# Altium project TMS320 EMIF Breakout.PrjPcb
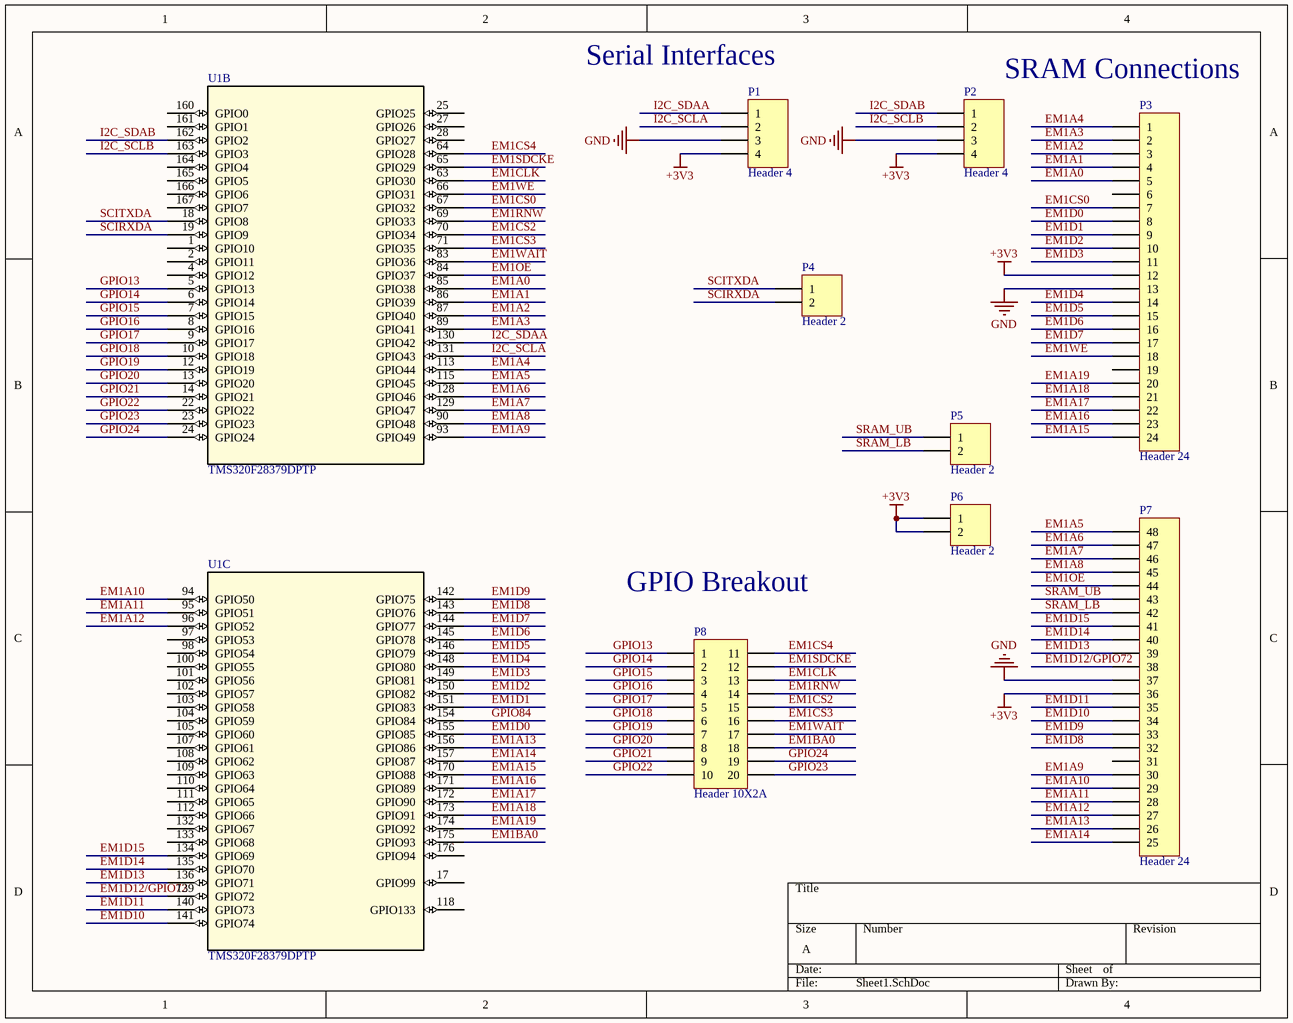
[diagram p0: Sheet1.SchDoc]
3 sheets, 94 parts. Net scope: global (net labels, ports and power ports of the same name join across sheets).
Board file: PCB1.PcbDoc
Sheets:
  Sheet1.SchDoc
  Sheet2.SchDoc
  Sheet3.SchDoc

## Sheet Sheet1.SchDoc
size A

### Parts
P1  Header 4  [HDR1X4]
P2  Header 4  [HDR1X4]
P3  Header 24  [HDR1X24]
P4  Header 2  [HDR1X2]
P5  Header 2  [HDR1X2]
P6  Header 2  [HDR1X2]
P7  Header 24  [HDR1X24]
P8  Header 10X2A  [HDR2X10_CEN]
U1  TMS320F28379DPTP  [PTP0176F_L]  (parts B,C of 5)

### Nets
+3V3: P1.4 P2.4 P3.12 P6.1 P6.2 P7.13(36)
GND: P1.3 P2.3 P3.13 P7.12(37)
EM1A0: P3.5 U1.85(GPIO38)
EM1A1: P3.4 U1.86(GPIO39)
EM1A2: P3.3 U1.87(GPIO40)
EM1A3: P3.2 U1.89(GPIO41)
EM1A4: P3.1 U1.113(GPIO44)
EM1A5: P7.1(48) U1.115(GPIO45)
EM1A6: P7.2(47) U1.128(GPIO46)
EM1A7: P7.3(46) U1.129(GPIO47)
EM1A8: P7.4(45) U1.90(GPIO48)
EM1A9: P7.19(30) U1.93(GPIO49)
EM1A10: P7.20(29) U1.94(GPIO50)
EM1A11: P7.21(28) U1.95(GPIO51)
EM1A12: P7.22(27) U1.96(GPIO52)
EM1A13: P7.23(26) U1.156(GPIO86)
EM1A14: P7.24(25) U1.157(GPIO87)
EM1A15: P3.24 U1.170(GPIO88)
EM1A16: P3.23 U1.171(GPIO89)
EM1A17: P3.22 U1.172(GPIO90)
EM1A18: P3.21 U1.173(GPIO91)
EM1A19: P3.20 U1.174(GPIO92)
EM1BA0: P8.18 U1.175(GPIO93)
EM1CLK: P8.13 U1.63(GPIO30)
EM1CS0: P3.7 U1.67(GPIO32)
EM1CS2: P8.15 U1.70(GPIO34)
EM1CS3: P8.16 U1.71(GPIO35)
EM1CS4: P8.11 U1.64(GPIO28)
EM1D0: P3.8 U1.155(GPIO85)
EM1D1: P3.9 U1.151(GPIO83)
EM1D2: P3.10 U1.150(GPIO82)
EM1D3: P3.11 U1.149(GPIO81)
EM1D4: P3.14 U1.148(GPIO80)
EM1D5: P3.15 U1.146(GPIO79)
EM1D6: P3.16 U1.145(GPIO78)
EM1D7: P3.17 U1.144(GPIO77)
EM1D8: P7.17(32) U1.143(GPIO76)
EM1D9: P7.16(33) U1.142(GPIO75)
EM1D10: P7.15(34) U1.141(GPIO74)
EM1D11: P7.14(35) U1.140(GPIO73)
EM1D12/GPIO72: P7.11(38) U1.139(GPIO72)
EM1D13: P7.10(39) U1.136(GPIO71)
EM1D14: P7.9(40) U1.135(GPIO70)
EM1D15: P7.8(41) U1.134(GPIO69)
EM1OE: P7.5(44) U1.84(GPIO37)
EM1RNW: P8.14 U1.69(GPIO33)
EM1SDCKE: P8.12 U1.65(GPIO29)
EM1WAIT: P8.17 U1.83(GPIO36)
EM1WE: P3.18 U1.66(GPIO31)
GPIO13: P8.1 U1.5(GPIO13)
GPIO14: P8.2 U1.6(GPIO14)
GPIO15: P8.3 U1.7(GPIO15)
GPIO16: P8.4 U1.8(GPIO16)
GPIO17: P8.5 U1.9(GPIO17)
GPIO18: P8.6 U1.10(GPIO18)
GPIO19: P8.7 U1.12(GPIO19)
GPIO20: P8.8 U1.13(GPIO20)
GPIO21: P8.9 U1.14(GPIO21)
GPIO22: P8.10 U1.22(GPIO22)
GPIO23: P8.20 U1.23(GPIO23)
GPIO24: P8.19 U1.24(GPIO24)
GPIO84: U1.154(GPIO84)
I2C_SCLA: P1.2 U1.131(GPIO43)
I2C_SCLB: P2.2 U1.163(GPIO3)
I2C_SDAA: P1.1 U1.130(GPIO42)
I2C_SDAB: P2.1 U1.162(GPIO2)
SCIRXDA: P4.2 U1.19(GPIO9)
SCITXDA: P4.1 U1.18(GPIO8)
SRAM_LB: P5.2 P7.7(42)
SRAM_UB: P5.1 P7.6(43)

Not connected (* = marked no-connect by the designer): P3 6 19; P7 18(31); U1 1(GPIO10) 2(GPIO11) 4(GPIO12) 17(GPIO99) 25(GPIO25) 27(GPIO26) 28(GPIO27) 97(GPIO53) 98(GPIO54) 100(GPIO55) 101(GPIO56) 102(GPIO57) 103(GPIO58) 104(GPIO59) 105(GPIO60) 107(GPIO61) 108(GPIO62) 109(GPIO63) 110(GPIO64) 111(GPIO65) 112(GPIO66) 118(GPIO133) 132(GPIO67) 133(GPIO68) 160(GPIO0) 161(GPIO1) 164(GPIO4) 165(GPIO5) 166(GPIO6) 167(GPIO7) 176(GPIO94)

### Notes on the sheet
- (near P1) Serial Interfaces
- SRAM Connections
- GPIO Breakout

### Library data of the parts
P1 P2 = Header 4: Header, 4-Pin; LatestRevisionDate: 17-Jul-2002; LatestRevisionNote: Re-released for DXP Platform.; Publisher: Altium Limited
P3 P7 = Header 24: Header, 24-Pin; LatestRevisionDate: 17-Jul-2002; LatestRevisionNote: Re-released for DXP Platform.; Publisher: Altium Limited
P4-P6 = Header 2: Header, 2-Pin; LatestRevisionDate: 17-Jul-2002; LatestRevisionNote: Re-released for DXP Platform.; Publisher: Altium Limited
P8 = Header 10X2A: Header, 10-Pin, Dual row; LatestRevisionDate: 17-Jul-2002; LatestRevisionNote: Re-released for DXP Platform.; Publisher: Altium Limited
U1 = TMS320F28379DPTP: Imported; PartNumber: TMS320F28379DPTPS; Manufacturer: Texas Instruments; RefDes: RefDes; TYPE: TYPE; Value: Value

## Sheet Sheet2.SchDoc
size A
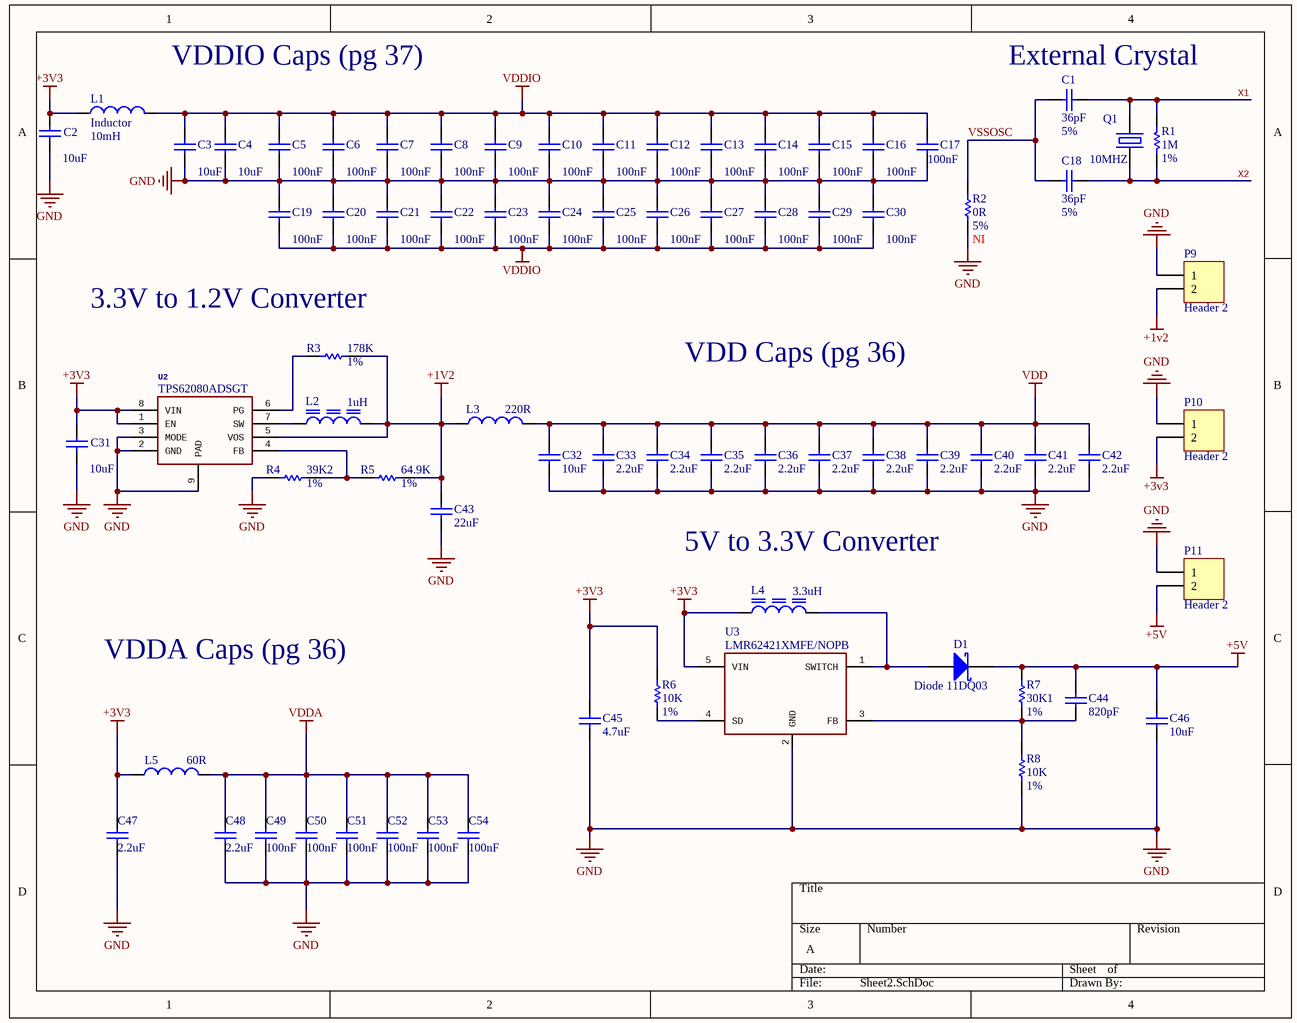
[diagram p1: Sheet2.SchDoc]

### Parts
C1  Rating: 5%  [C0805]  (hidden comment: 36pF)
C2  value 10uF  [C0805]  (hidden comment: Cap Semi)
C3  value 10uF  [C0805]  (hidden comment: Cap Semi)
C4  value 10uF  [C0805]  (hidden comment: Cap Semi)
C5  value 100nF  [C0805]  (hidden comment: Cap Semi)
C6  value 100nF  [C0805]
C7  value 100nF  [C0805]  (hidden comment: Cap Semi)
C8  value 100nF  [C0805]  (hidden comment: Cap Semi)
C9  value 100nF  [C0805]  (hidden comment: Cap Semi)
C10  value 100nF  [C0805]
C11  value 100nF  [C0805]  (hidden comment: Cap Semi)
C12  value 100nF  [C0805]  (hidden comment: Cap Semi)
C13  value 100nF  [C0805]  (hidden comment: Cap Semi)
C14  value 100nF  [C0805]  (hidden comment: Cap Semi)
C15  value 100nF  [C0805]  (hidden comment: Cap Semi)
C16  value 100nF  [C0805]  (hidden comment: Cap Semi)
C17  value 100nF  [C0805]  (hidden comment: Cap Semi)
C18  Rating: 5%  [C0805]  (hidden comment: 36pF)
C19  value 100nF  [C0805]  (hidden comment: Cap Semi)
C20  value 100nF  [C0805]
C21  value 100nF  [C0805]  (hidden comment: Cap Semi)
C22  value 100nF  [C0805]  (hidden comment: Cap Semi)
C23  value 100nF  [C0805]  (hidden comment: Cap Semi)
C24  value 100nF  [C0805]
C25  value 100nF  [C0805]  (hidden comment: Cap Semi)
C26  value 100nF  [C0805]  (hidden comment: Cap Semi)
C27  value 100nF  [C0805]  (hidden comment: Cap Semi)
C28  value 100nF  [C0805]  (hidden comment: Cap Semi)
C29  value 100nF  [C0805]  (hidden comment: Cap Semi)
C30  value 100nF  [C0805]  (hidden comment: Cap Semi)
C31  value 10uF  [C0805]  (hidden comment: Cap Semi)
C32  10uF  [C0805]
C33  2.2uF  [C0805]
C34  2.2uF  [C0805]
C35  2.2uF  [C0805]
C36  2.2uF  [C0805]
C37  2.2uF  [C0805]
C38  2.2uF  [C0805]
C39  2.2uF  [C0805]
C40  2.2uF  [C0805]
C41  2.2uF  [C0805]
C42  2.2uF  [C0805]
C43  22uF  [C0805]
C44  820pF  [C0805]
C45  4.7uF  [C0805]
C46  10uF  [C0805]
C47  2.2uF  [C0805]
C48  2.2uF  [C0805]
C49  100nF  [C0805]
C50  100nF  [C0805]
C51  100nF  [C0805]
C52  100nF  [C0805]
C53  100nF  [C0805]
C54  100nF  [C0805]
D1  Diode 11DQ03  [DO-204AL]
L1  Inductor  value 10mH  [6-0805_L]
L2  1uH  [6-0805_L]
L3  220R  [6-0805_L]
L4  3.3uH  [6-0805_L]
L5  60R  [6-0805_L]
P9  Header 2  [HDR1X2]
P10  Header 2  [HDR1X2]
P11  Header 2  [HDR1X2]
Q1  value 10MHZ  [HC-49U]  (hidden comment: ATS100B-E)
R1  Rating: 1%  [6-0805_L]  (hidden comment: 1M)
R2  Rating: 5%  ASSY: NI  [6-0805_L]  (hidden comment: 0R)
R3  Rating: 1%  [6-0805_L]  (hidden comment: 178K)
R4  Rating: 1%  [6-0805_L]  (hidden comment: 39K2)
R5  Rating: 1%  [6-0805_L]  (hidden comment: 64.9K)
R6  Rating: 1%  [6-0805_L]  (hidden comment: 10K)
R7  Rating: 1%  [6-0805_L]  (hidden comment: 30K1)
R8  Rating: 1%  [6-0805_L]  (hidden comment: 10K)
U2  TPS62080ADSGT  [SON50P200X200X80-9N]
U3  LMR62421XMFE/NOPB  [DBV5-L]

### Nets
+1V2: C43.2 L2.2 L3.1 P9.2 R3.2 R5.2 U2.5(VOS)
+3V3: C2.2 C31.2 C45.2 C47.2 L1.1 L4.1 L5.1 P10.2 R6.1 U2.1(EN) U2.8(VIN) U3.5(VIN)
+5V: C44.2 C46.1 D1.2(K) P11.2 R7.1
GND: C2.1 C3.1 C4.1 C5.1 C6.1 C7.1 C8.1 C9.1 C10.1 C11.1 C12.1 C13.1 C14.1 C15.1 C16.1 C17.1 C19.2 C20.2 C21.2 C22.2 C23.2 C24.2 C25.2 C26.2 C27.2 C28.2 C29.2 C30.2 C31.1 C32.1 C33.1 C34.1 C35.1 C36.1 C37.1 C38.1 C39.1 C40.1 C41.1 C42.1 C43.1 C45.1 C46.2 C47.1 C48.1 C49.1 C50.1 C51.1 C52.1 C53.1 C54.1 P9.1 P10.1 P11.1 R2.2 R4.1 R8.2 U2.2(GND) U2.3(MODE) U2.9(PAD) U3.2(GND)
VDD: C32.2 C33.2 C34.2 C35.2 C36.2 C37.2 C38.2 C39.2 C40.2 C41.2 C42.2 L3.2
VDDA: C48.2 C49.2 C50.2 C51.2 C52.2 C53.2 C54.2 L5.2
VDDIO: C3.2 C4.2 C5.2 C6.2 C7.2 C8.2 C9.2 C10.2 C11.2 C12.2 C13.2 C14.2 C15.2 C16.2 C17.2 C19.1 C20.1 C21.1 C22.1 C23.1 C24.1 C25.1 C26.1 C27.1 C28.1 C29.1 C30.1 L1.2
VSSOSC: C1.2 C18.2 R2.1
X1: C1.1 Q1.2 R1.2
X2: C18.1 Q1.1 R1.1
NetC44_1: C44.1 R7.2 R8.1 U3.3(FB)
NetD1_1: D1.1(A) L4.2 U3.1(SWITCH)
NetL2_1: L2.1 U2.7(SW)
NetR3_1: R3.1 U2.6(PG)
NetR4_2: R4.2 R5.1 U2.4(FB)
NetR6_2: R6.2 U3.4(SD)

### Notes on the sheet
- VDDIO Caps (pg 37)
- (near C1) External Crystal
- 3.3V to 1.2V Converter
- VDD Caps (pg 36)
- 5V to 3.3V Converter
- VDDA Caps (pg 36)

### Library data of the parts
C1 C18 = 1004001100255: CAP,36pF,+/-5%,C0G,50V,SMD0402; Manufacturer: MURATA; Manufacturer Part Number: GRM1555C1H360JA01D; Embest PN: 1004001100255; Value: 36pF; Part Type: Ceramic Capacitor
C2-C4 C31 = Cap Semi: 10uF; Published: 8-Jun-2000; LatestRevisionDate: 29-May-2009; LatestRevisionNote: IPC-7351 Footprint Added.; PackageReference: C1206; Publisher: Altium Limited; PackageDescription: Chip Capacitor
C5-C17 C19-C30 = Cap Semi: 100nF; Published: 8-Jun-2000; LatestRevisionDate: 29-May-2009; LatestRevisionNote: IPC-7351 Footprint Added.; PackageReference: C1206; Publisher: Altium Limited; PackageDescription: Chip Capacitor
C32 = 1004001100128: CAP,10UF,+/-20%,X5R,6.3V,SMD0603; Manufacturer: MURATA; Manufacturer Part Number: GRM188R60J106ME47D; Rating: 20%; Embest PN: 1004001100128; Value: 10uF; Part Type: Ceramic Capacitor
C33-C42 C47 C48 = 1004001100059: CAP,2.2UF,+/-20%,X5R,6.3V,SMD0402; Manufacturer: MURATA; Manufacturer Part Number: GRM155R60J225ME15D; Rating: 20%; Embest PN: 1004001100059; Value: 2.2uF; Part Type: Ceramic Capacitor
C43 = 1004001100130: CAP,22UF,+/-20%,X5R,6.3V,SMD0603; Manufacturer: MURATA; Manufacturer Part Number: GRM188R60J226MEA0D; Rating: 20%; Embest PN: 1004001100130; Value: 22uF; Part Type: Ceramic Capacitor
C44 = 1004001100029: CAP,820PF,+/-5%,C0G,50V,SMD0402; Manufacturer: MURATA; Manufacturer Part Number: GRM1555C1H821JA01D; Rating: 5%; Embest PN: 1004001100029; Value: 820pF; Part Type: Ceramic Capacitor
C45 = 1004001100218: CAP,4.7UF,+/-20%,X5R,6.3V,SMD0402 fix PN add D（20151023）; Manufacturer: MURATA; Manufacturer Part Number: GRM155R60J475ME47D; Rating: 20%; Embest PN: 1004001100218; Value: 4.7uF; Part Type: Ceramic Capacitor
C46 = 1004001100183: CAP,10UF,+/-10%,X7R,25V,SMD1210; Manufacturer: MURATA; Manufacturer Part Number: GRM32DR71E106KA12L; Rating: 10%; Embest PN: 1004001100183; Value: 10uF; Part Type: Ceramic Capacitor
C49-C54 = 1004001100187: CAP,100NF(0.1uf),+/-10%,X5R,10V,SMD0402; Manufacturer: MURATA; Manufacturer Part Number: GRM155R61A104KA01D; Rating: 10%; Embest PN: 1004001100187; Value: 100nF; Part Type: Ceramic Capacitor
D1 = Diode 11DQ03: Schottky Rectifier; Published: 8-Jun-2000; LatestRevisionDate: 17-Jul-2002; LatestRevisionNote: Re-released for DXP Platform.; DatasheetVersion: Dec-1997; PackageReference: DO-204AL; Publisher: Altium Limited; PackageDescription: Diode, Axial; Body 5.2 x 2.7 mm (LxDia. max), Lead Dia. 0.86 mm (max); Code_JEDEC: DO-204-AL; ComponentLink1Description: Manufacturer Link; ComponentLink1URL: http://www.irf.com/; ComponentLink2Description: Datasheet; ComponentLink2URL: http://www.irf.com/product-info/datasheets/data/11dq03.pdf
L1 = Inductor: Code_IEC: 1005; Published: 8-Jun-2000; LatestRevisionDate: 29-May-2009; LatestRevisionNote: IPC-7351 Footprint Added.; PackageReference: 0402-A; Publisher: Altium Limited; PackageDescription: Chip Inductor; Code_JEITA: 0402
L2 = 1005001100053: FIXED IND 1UH 1.62A 40 MOHM SMD,+/-30%; Manufacturer: MURATA; Manufacturer Part Number: LQH3NPN1R0NJ0L; Embest PN: 1005001100053; Value: 1uH; Part Type: Inductor; Rating: 1.62A
L3 = 1005005100064: FERRITE BEAD 220 OHM 0402,+/-25%; Manufacturer: Taiyo Yuden; Manufacturer Part Number: BKP1005EM221-T; Embest PN: 1005005100064; Value: 220R; Part Type: Ferrite Bead
L4 = 1005004100014: Power Inductor,Magnetic shielded,3.3uH,1.4A,0.085ohm,3.8X3.8X1.6mm,SMD; Manufacturer: SUMIDA; Manufacturer Part Number: CDRH3D16/HPNP-3R3NC; Embest PN: 1005004100014; Value: 3.3uH; Part Type: Inductor; Rating: 1.4A
L5 = 1005005100005: Ferrite Bead,60ohm@100MHz,+/-25%,1700mA,0.06ohm,SMD0402; Manufacturer: MURATA; Manufacturer Part Number: BLM15PD600SN1D; Embest PN: 1005005100005; Value: 60R; Part Type: Ferrite Bead; Rating: 1700mA
P9-P11 = Header 2: Header, 2-Pin; LatestRevisionDate: 17-Jul-2002; LatestRevisionNote: Re-released for DXP Platform.; Publisher: Altium Limited
Q1 = 1008002200125: Crystal 10.0000MHz 30ppm 18pF 60 Ohm -40°C - 85°C Through Hole HC49/US; Manufacturer: CTS; Embest PN: 1008002200125; Part Type: Crystal; Manufacturer Part Number: ATS100B-E
R1 = 1003001100155: RES,1M,+/-1%,1/16W,SMD0402; Manufacturer: YAGEO; Manufacturer Part Number: RC0402FR-071ML; Embest PN: 1003001100155; Value: 1M; Part Type: Thick film Resistor
R2 = 1003001100001: RES,0R,+/-5%,1/16W,SMD0402; Manufacturer: YAGEO; Manufacturer Part Number: RC0402JR-070RL; Embest PN: 1003001100001; Value: 0R; Part Type: Thick film Resistor
R3 = 1003001100723: RES, 178K OHM, 1%, 1/10W, SMD0402; Manufacturer: PANASONIC; Manufacturer Part Number: ERJ-2RKF1783X; Embest PN: 1003001100723; Value: 178K; Part Type: Thick film Resistor
R4 = 1003001100098: RES,39K2,+/-1%,1/16W,SMD0402; Manufacturer: YAGEO; Manufacturer Part Number: RC0402FR-0739K2L; Embest PN: 1003001100098; Value: 39K2; Part Type: Thick film Resistor
R5 = 1003001100730: RES, 64.9K OHM, 1%, 1/10W, SMD0402; Manufacturer: PANASONIC; Manufacturer Part Number: ERJ-2RKF6492X; Embest PN: 1003001100730; Value: 64.9K; Part Type: Thick film Resistor
R6 R8 = 1003001100071: RES,10K,+/-1%,1/16W,SMD0402; Manufacturer: YAGEO; Manufacturer Part Number: RC0402FR-0710KL; Embest PN: 1003001100071; Value: 10K; Part Type: Thick film Resistor
R7 = 1003001100091: RES,30K1,+/-1%,1/16W,SMD0402; Manufacturer: YAGEO; Manufacturer Part Number: RC0402FR-0730K1L; Embest PN: 1003001100091; Value: 30K1; Part Type: Thick film Resistor
U2 = 1002005100089C: IC REG BUCK SYNC ADJ 1.2A 8WSON; Manufacturer: TI; Embest PN: 1002005100089C; Value: TPS62080ADSGT; Part Type: DC-DC; Manufacturer Part Number: TPS62080ADSGT
U3 = 1002005100073C: Conv DC-DC Single Step Up 2.7V to 5.5V 5-Pin SOT-23 T/R ,CUSTOMER SUPPLY; Manufacturer: TI; Embest PN: 1002005100073C; Value: LMR62421XMFE/NOPB; Part Type: DC-DC; Manufacturer Part Number: LMR62421XMFE/NOPB

## Sheet Sheet3.SchDoc
size A
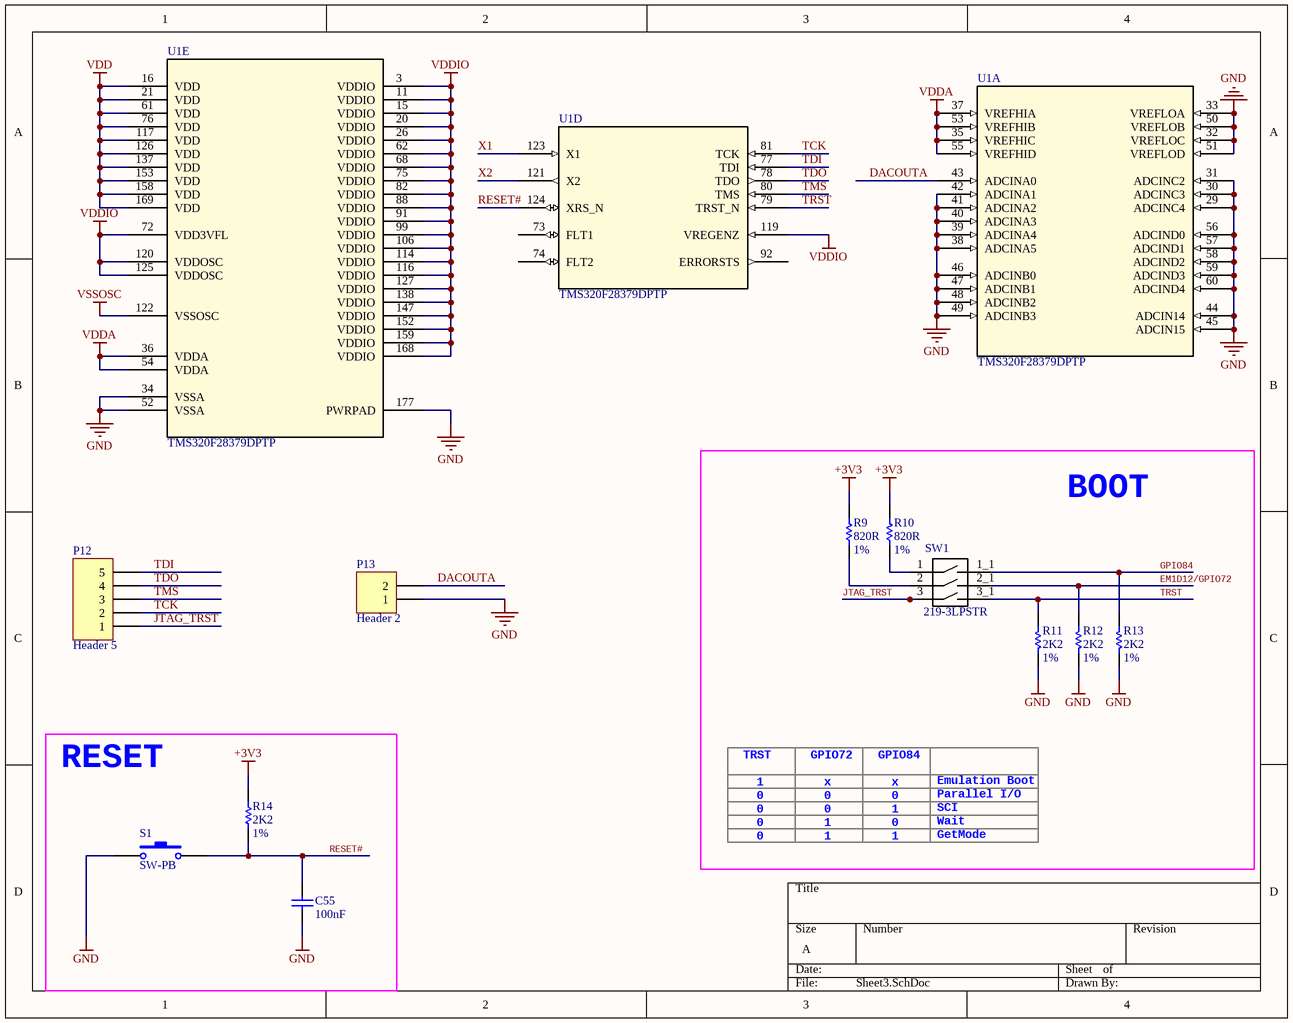
[diagram p2: Sheet3.SchDoc]

### Parts
C55  100nF  [C0805]
P12  Header 5  [HDR1X5]
P13  Header 2  [HDR1X2]
R9  Rating: 1%  [6-0805_L]  (hidden comment: 820R)
R10  Rating: 1%  [6-0805_L]  (hidden comment: 820R)
R11  Rating: 1%  [6-0805_L]  (hidden comment: 2K2)
R12  Rating: 1%  [6-0805_L]  (hidden comment: 2K2)
R13  Rating: 1%  [6-0805_L]  (hidden comment: 2K2)
R14  Rating: 1%  [6-0805_L]  (hidden comment: 2K2)
S1  SW-PB  [SW PB]
SW1  219-3LPSTR  [3Switch*SW_219-3LPSTR3W219-3LPSTR(Primary)]
U1  TMS320F28379DPTP  [PTP0176F_L]  (parts A,D,E of 5)

### Blocks framed on the sheet
BOOT: R9-R13 SW1
RESET: C55 R14 S1

### Nets
+3V3: R9.2 R10.2 R14.2
GND: C55.2 P13.1 R11.1 R12.1 R13.1 S1.1 U1.29(ADCINC4) U1.30(ADCINC3) U1.31(ADCINC2) U1.32(VREFLOC) U1.33(VREFLOA) U1.34(VSSA) U1.38(ADCINA5) U1.39(ADCINA4) U1.40(ADCINA3) U1.41(ADCINA2) U1.42(ADCINA1) U1.44(ADCIN14) U1.45(ADCIN15) U1.46(ADCINB0) U1.47(ADCINB1) U1.48(ADCINB2) U1.49(ADCINB3) U1.50(VREFLOB) U1.51(VREFLOD) U1.52(VSSA) U1.56(ADCIND0) U1.57(ADCIND1) U1.58(ADCIND2) U1.59(ADCIND3) U1.60(ADCIND4) U1.177(PWRPAD)
VDD: U1.16(VDD) U1.21(VDD) U1.61(VDD) U1.76(VDD) U1.117(VDD) U1.126(VDD) U1.137(VDD) U1.153(VDD) U1.158(VDD) U1.169(VDD)
VDDA: U1.35(VREFHIC) U1.36(VDDA) U1.37(VREFHIA) U1.53(VREFHIB) U1.54(VDDA) U1.55(VREFHID)
VDDIO: U1.3(VDDIO) U1.11(VDDIO) U1.15(VDDIO) U1.20(VDDIO) U1.26(VDDIO) U1.62(VDDIO) U1.68(VDDIO) U1.72(VDD3VFL) U1.75(VDDIO) U1.82(VDDIO) U1.88(VDDIO) U1.91(VDDIO) U1.99(VDDIO) U1.106(VDDIO) U1.114(VDDIO) U1.116(VDDIO) U1.119(VREGENZ) U1.120(VDDOSC) U1.125(VDDOSC) U1.127(VDDIO) U1.138(VDDIO) U1.147(VDDIO) U1.152(VDDIO) U1.159(VDDIO) U1.168(VDDIO)
VSSOSC: U1.122(VSSOSC)
DACOUTA: P13.2 U1.43(ADCINA0)
EM1D12/GPIO72: R12.2 SW1.2_1
GPIO84: R13.2 SW1.1_1
JTAG_TRST: P12.1 SW1.3
RESET#: C55.1 R14.1 S1.2 U1.124(XRS_N)
TCK: P12.2 U1.81(TCK)
TDI: P12.5 U1.77(TDI)
TDO: P12.4 U1.78(TDO)
TMS: P12.3 U1.80(TMS)
TRST: R11.2 SW1.3_1 U1.79(TRST_N)
X1: U1.123(X1)
X2: U1.121(X2)
NetR9_1: R9.1 SW1.2
NetR10_1: R10.1 SW1.1

Not connected (* = marked no-connect by the designer): U1 73(FLT1) 74(FLT2) 92(ERRORSTS)

### Notes on the sheet
- TRST
- GPIO72
- GPIO84
- 1
- 0
- x
- Emulation Boot
- Parallel I/O
- SCI
- Wait
- GetMode

### Library data of the parts
C55 = 1004001100187: as C49 on sheet Sheet2; Embest PN: 1004001100187; Value: 100nF; Part Type: Ceramic Capacitor
P12 = Header 5: Header, 5-Pin; LatestRevisionDate: 17-Jul-2002; LatestRevisionNote: Re-released for DXP Platform.; Publisher: Altium Limited
P13 = Header 2: Header, 2-Pin; LatestRevisionDate: 17-Jul-2002; LatestRevisionNote: Re-released for DXP Platform.; Publisher: Altium Limited
R9 R10 = 1003001100482: RES,820R,+/-1%,1/16W,SMD0402; Manufacturer: YAGEO; Manufacturer Part Number: RC0402FR-07820RL; Embest PN: 1003001100482; Value: 820R; Part Type: Thick film Resistor
R11-R14 = 1003001100045: RES,2K2,+/-1%,1/16W,SMD0402; Manufacturer: YAGEO; Manufacturer Part Number: RC0402FR-072K2L; Embest PN: 1003001100045; Value: 2K2; Part Type: Thick film Resistor
S1 = SW-PB: DIGIKEY SW400-ND; Published: 24-Mar-1999; LatestRevisionDate: 17-Jul-2002; LatestRevisionNote: Re-released for DXP Platform.; Publisher: Altium Limited
SW1 = 219-3LPSTR: Dip Switch SPST 3 Position Surface Mount Slide _Standard_ Actuator 100mA 20VDC; MF: CTS Electrocomponents; SnapEDA_Link: https://www.snapeda.com/parts/219-3LPSTR/CTS%20Electrocomponents/view-part/571936/?ref=snap; Digi-Key_Part_Number: CT3115CT-ND; MP: 219-3LPSTR; Digi-Key_Purchase_URL: https://www.digikey.com/product-detail/en/cts-electrocomponents/219-3LPSTR/CT3115CT-ND/5875767?utm_source=snapeda&utm_medium=aggregator&utm_campaign=symbol; Package: None; Value: *
U1 = TMS320F28379DPTP: as U1 on sheet Sheet1; RefDes: RefDes; TYPE: TYPE; Value: Value

## Nets that join several sheets
+3V3: Sheet1 (6 pins), Sheet2 (12 pins), Sheet3 (R9.2 R10.2 R14.2)
GND: Sheet1 (P1.3 P2.3 P3.13 P7.12), Sheet2 (61 pins), Sheet3 (32 pins)
VDD: Sheet2 (12 pins), Sheet3 (10 pins)
VDDA: Sheet2 (8 pins), Sheet3 (6 pins)
VDDIO: Sheet2 (28 pins), Sheet3 (25 pins)
VSSOSC: Sheet2 (C1.2 C18.2 R2.1), Sheet3 (U1.122)
EM1D12/GPIO72: Sheet1 (P7.11 U1.139), Sheet3 (R12.2 SW1.2_1)
GPIO84: Sheet1 (U1.154), Sheet3 (R13.2 SW1.1_1)
X1: Sheet2 (C1.1 Q1.2 R1.2), Sheet3 (U1.123)
X2: Sheet2 (C18.1 Q1.1 R1.1), Sheet3 (U1.121)